# Altium schematic sheet Sheet1.SchDoc
size A4
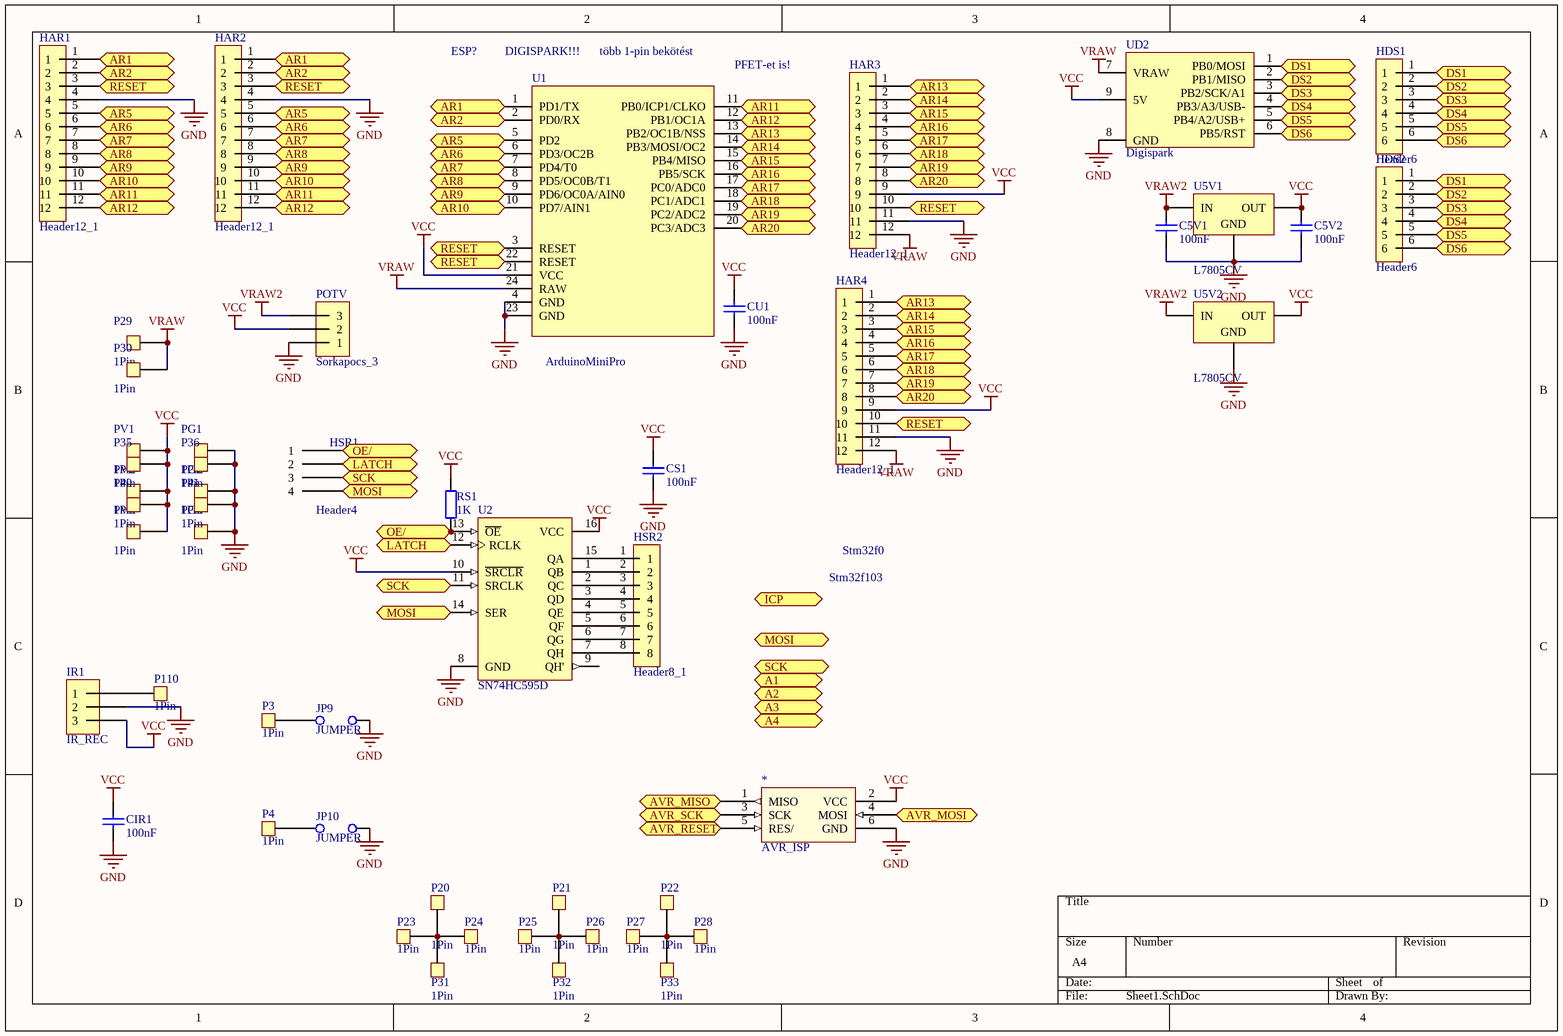
[diagram p0: Sheet1.SchDoc]

## Parts
*  AVR_ISP  [HEADER6]
C5V1  100nF  [FP_1206_CAP_125]
C5V2  100nF  [FP_1206_CAP_125]
CIR1  100nF  [FP_0805_CAP_085]
CS1  100nF  [FP_0805_CAP_085]
CU1  100nF  [FP_0805_CAP_085]
HAR1  Header12_1  [HEADER12x1]
HAR2  Header12_1  [HEADER12x1]
HAR3  Header12_1  [HEADER12x1]
HAR4  Header12_1  [HEADER12x1]
HDS1  Header6  [HEADER6x1]
HDS2  Header6  [HEADER6x1]
HSR1  Header4  [FP_CONN4_TUSKE_254MM]
HSR2  Header8_1  [HEADER8x1]
IR1  IR_REC  [FP_CONN3_TUSKE_254MM]
JP9  JUMPER  [FP_CONN2_TUSKE_254MM]
JP10  JUMPER  [FP_CONN2_TUSKE_254MM]
P3  1Pin  [Header1]
P4  1Pin  [Header1]
P20  1Pin  [Header1]
P21  1Pin  [Header1]
P22  1Pin  [Header1]
P23  1Pin  [Header1]
P24  1Pin  [Header1]
P25  1Pin  [Header1]
P26  1Pin  [Header1]
P27  1Pin  [Header1]
P28  1Pin  [Header1]
P29  1Pin  [Header1]
P30  1Pin  [Header1]
P31  1Pin  [Header1]
P32  1Pin  [Header1]
P33  1Pin  [Header1]
P35  1Pin  [Header1]
P36  1Pin  [Header1]
P40  1Pin  [Header1]
P41  1Pin  [Header1]
P110  1Pin  [Header1]
PG1  1Pin  [Header1]
PG2  1Pin  [Header1]
PG3  1Pin  [Header1]
POTV  Sorkapocs_3  [SORKAPOCS_3]
PV1  1Pin  [Header1]
PV2  1Pin  [Header1]
PV3  1Pin  [Header1]
RS1  value 1K  [0805]  (hidden comment: Resistor)
U1  ArduinoMiniPro  [DIP24]
U2  SN74HC595D  [D016_L]
U5V1  L7805CV  [SOT-223]
U5V2  L7805CV  [TO220ABN]
UD2  Digispark  [Digispark]

## Ports
A1, A2, A3, A4, AR1, AR2, AR5, AR6, AR7, AR8, AR9, AR10, AR11, AR12, AR13, AR14, AR15, AR16, AR17, AR18, AR19, AR20, AVR_MISO, AVR_MOSI, AVR_RESET, AVR_SCK, DS1, DS2, DS3, DS4, DS5, DS6, ICP, LATCH, MOSI, OE/, RESET, SCK

## Nets
GND: *.6(GND) C5V1.2 C5V2.2 CIR1.1 CS1.1 CU1.1 HAR1.4 HAR2.4 HAR3.11 HAR4.11 IR1.2 JP9.1(C1) JP10.2(C2) P36.1 P41.1 PG1.1 PG2.1 PG3.1 POTV.1 U1.4(GND) U1.23(GND) U2.8(GND) U5V1.GND U5V2.GND UD2.8(GND)
VCC: *.2(VCC) C5V2.1 CIR1.2 CS1.2 CU1.2 HAR3.9 HAR4.9 IR1.3 P35.1 P40.1 POTV.2 PV1.1 PV2.1 PV3.1 RS1.1 U1.21(VCC) U2.10(~{SRCLR}) U2.16(VCC) U5V1.OUT U5V2.OUT UD2.9(5V)
VRAW: HAR3.12 HAR4.12 P29.1 P30.1 U1.24(RAW) UD2.7(VRAW)
VRAW2: C5V1.1 POTV.3 U5V1.IN U5V2.IN
AR1: HAR1.1 HAR2.1 U1.1(PD1/TX) ; port AR1
AR2: HAR1.2 HAR2.2 U1.2(PD0/RX) ; port AR2
AR5: HAR1.5 HAR2.5 U1.5(PD2) ; port AR5
AR6: HAR1.6 HAR2.6 U1.6(PD3/OC2B) ; port AR6
AR7: HAR1.7 HAR2.7 U1.7(PD4/T0) ; port AR7
AR8: HAR1.8 HAR2.8 U1.8(PD5/OC0B/T1) ; port AR8
AR9: HAR1.9 HAR2.9 U1.9(PD6/OC0A/AIN0) ; port AR9
AR10: HAR1.10 HAR2.10 U1.10(PD7/AIN1) ; port AR10
AR11: HAR1.11 HAR2.11 U1.11(PB0/ICP1/CLKO) ; port AR11
AR12: HAR1.12 HAR2.12 U1.12(PB1/OC1A) ; port AR12
AR13: HAR3.1 HAR4.1 U1.13(PB2/OC1B/NSS) ; port AR13
AR14: HAR3.2 HAR4.2 U1.14(PB3/MOSI/OC2) ; port AR14
AR15: HAR3.3 HAR4.3 U1.15(PB4/MISO) ; port AR15
AR16: HAR3.4 HAR4.4 U1.16(PB5/SCK) ; port AR16
AR17: HAR3.5 HAR4.5 U1.17(PC0/ADC0) ; port AR17
AR18: HAR3.6 HAR4.6 U1.18(PC1/ADC1) ; port AR18
AR19: HAR3.7 HAR4.7 U1.19(PC2/ADC2) ; port AR19
AR20: HAR3.8 HAR4.8 U1.20(PC3/ADC3) ; port AR20
AVR_MISO: *.1(MISO) ; port AVR_MISO
AVR_MOSI: *.4(MOSI) ; port AVR_MOSI
AVR_RESET: *.5(RES/) ; port AVR_RESET
AVR_SCK: *.3(SCK) ; port AVR_SCK
DS1: HDS1.1 HDS2.1 UD2.1(PB0/MOSI) ; port DS1
DS2: HDS1.2 HDS2.2 UD2.2(PB1/MISO) ; port DS2
DS3: HDS1.3 HDS2.3 UD2.3(PB2/SCK/A1) ; port DS3
DS4: HDS1.4 HDS2.4 UD2.4(PB3/A3/USB-) ; port DS4
DS5: HDS1.5 HDS2.5 UD2.5(PB4/A2/USB+) ; port DS5
DS6: HDS1.6 HDS2.6 UD2.6(PB5/RST) ; port DS6
LATCH: HSR1.2 U2.12(RCLK) ; port LATCH
MOSI: HSR1.4 U2.14(SER) ; port MOSI
OE/: HSR1.1 RS1.2 U2.13(~{OE}) ; port OE/
RESET: HAR1.3 HAR2.3 HAR3.10 HAR4.10 U1.3(RESET) U1.22(RESET) ; port RESET
SCK: HSR1.3 U2.11(SRCLK) ; port SCK
NetHSR2_1: HSR2.1 U2.15(QA)
NetHSR2_2: HSR2.2 U2.1(QB)
NetHSR2_3: HSR2.3 U2.2(QC)
NetHSR2_4: HSR2.4 U2.3(QD)
NetHSR2_5: HSR2.5 U2.4(QE)
NetHSR2_6: HSR2.6 U2.5(QF)
NetHSR2_7: HSR2.7 U2.6(QG)
NetHSR2_8: HSR2.8 U2.7(QH)
NetIR1_1: IR1.1 P110.1
NetJP9_2: JP9.2(C2) P3.1
NetJP10_1: JP10.1(C1) P4.1
NetP20_1: P20.1 P23.1 P24.1 P31.1
NetP21_1: P21.1 P25.1 P26.1 P32.1
NetP22_1: P22.1 P27.1 P28.1 P33.1

Not connected (* = marked no-connect by the designer): U2 9(QH')

## Notes on the sheet
- ESP?
- (near U1) DIGISPARK!!!
- (near U1) több 1-pin bekötést
- (near U1) PFET-et is!
- Stm32f103
- Stm32f0

## Library data of the parts
C5V1 C5V2 CIR1 CS1 CU1 = CAP: Capacitor; Value: 100nF
IR1 = Sorkapocs_3
JP9 JP10 = JUMPER: Jumper Wire; Supplier: Farnell 1668537×1/6
U2 = SN74HC595D: 8-Bit Shift Register with 3-State Output Registers; Published: 8-Jun-2000; LatestRevisionDate: 13-Apr-2006; LatestRevisionNote: IPC-7351 Footprint Added.; DatasheetVersion: May-1997; PackageVersion: Jan-1998; PackageReference: D016; Publisher: Altium Limited; PackageDescription: 16-Pin Small Outline Integrated Circuit 1.27 mm Pitch; Code_IPC: SOIC127P600-16; ComponentLink1Description: Manufacturer Link; ComponentLink1URL: http://www.ti.com/; ComponentLink2Description: Datasheet; ComponentLink2URL: http://www-s.ti.com/sc/ds/sn74hc595.pdf
U5V1 = L7805CV: Positive Voltage Regulator; pin to pad: GND>1 IN>3 OUT>2; Note: Tab is connected to pin 3 (GND).; Published: 24-Aug-2001; LatestRevisionDate: 17-Jul-2002; LatestRevisionNote: Re-released for DXP Platform.; DatasheetVersion: Dec-1998; PackageVersion: Jun-1998; PackageReference: TO220ABN; Publisher: Altium Limited; PackageDescription: TO, Thru-Hole, Vertical, Heatsink Mounted; 3 In-Line Leads; Pitch 2.54 mm; Pin sequence 1, 3, 2; ComponentLink1Description: Manufacturer Link; ComponentLink1URL: http://www.st.com/
U5V2 = L7805CV: Positive Voltage Regulator; pin to pad: GND>3 IN>1 OUT>2; Note: Tab is connected to pin 3 (GND).; Published: 24-Aug-2001; LatestRevisionDate: 17-Jul-2002; LatestRevisionNote: Re-released for DXP Platform.; DatasheetVersion: Dec-1998; PackageVersion: Jun-1998; PackageReference: TO220ABN; Publisher: Altium Limited; PackageDescription: TO, Thru-Hole, Vertical, Heatsink Mounted; 3 In-Line Leads; Pitch 2.54 mm; Pin sequence 1, 3, 2; ComponentLink1Description: Manufacturer Link; ComponentLink1URL: http://www.st.com/
RS1 = Resistor: Published: 8-Jun-2000; LatestRevisionDate: 17-Jul-2002; LatestRevisionNote: Re-released for DXP Platform.; PackageReference: AXIAL-0.4; Publisher: Altium Limited